# EAGLE design Biosensor_v4_3_20141129 (EAGLE 6.6.0)
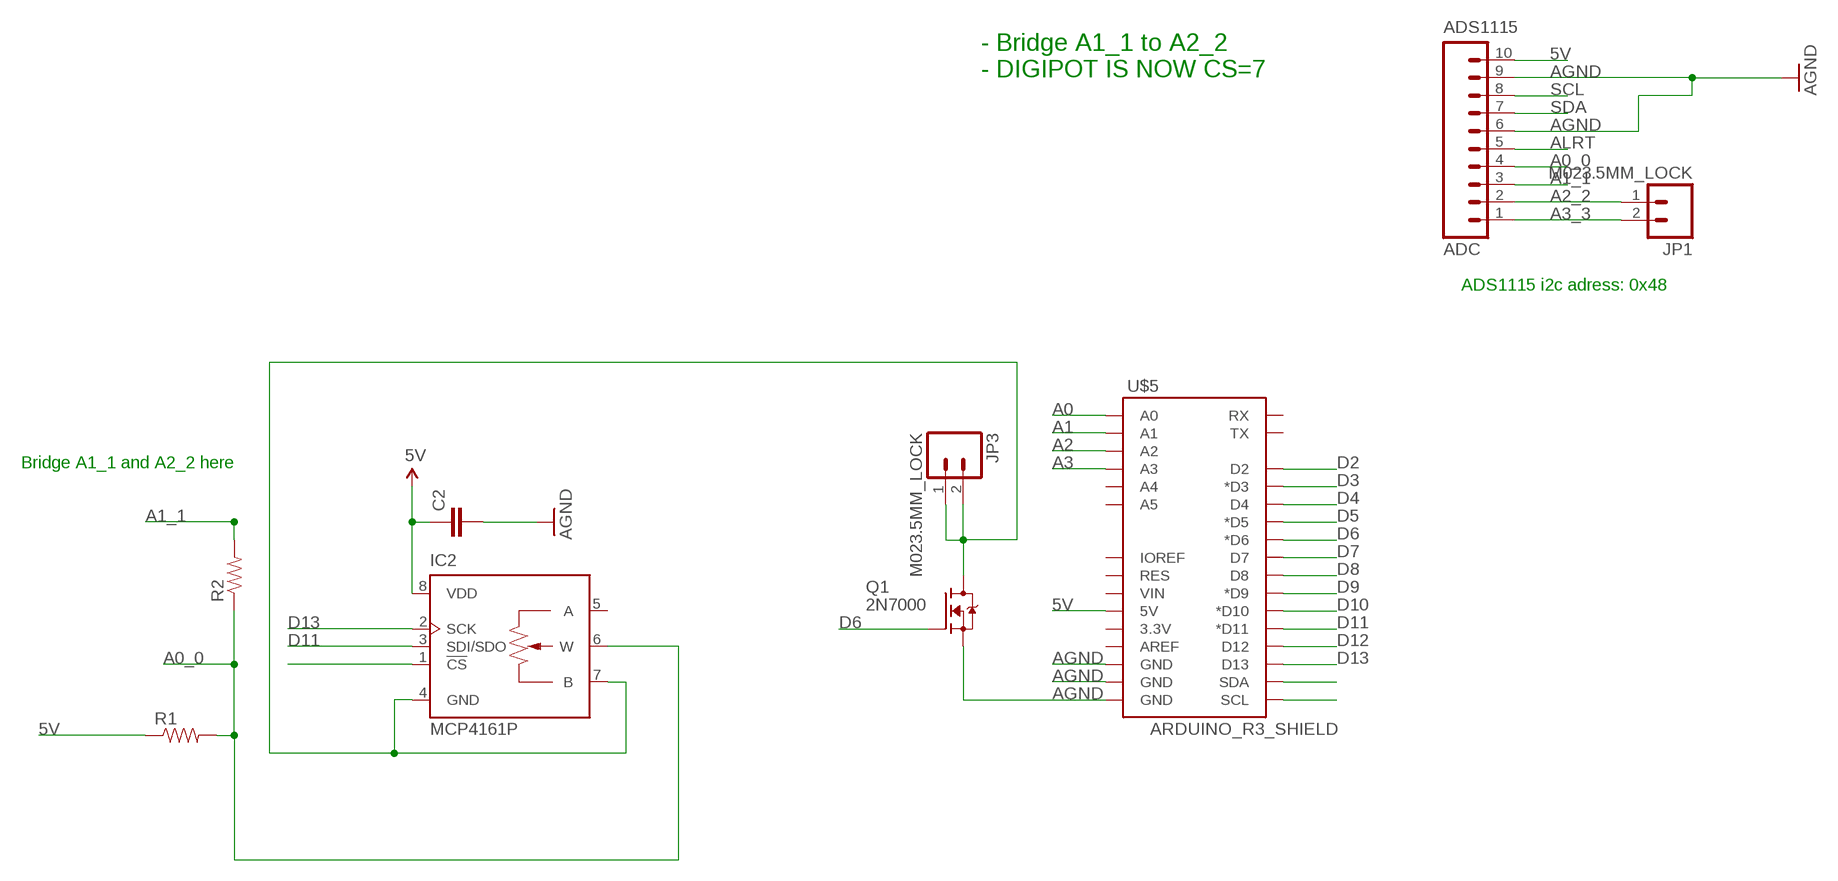
[diagram p0: schematic, sheet 1]

## Parts
ADS1115  ADC  M10LOCK  [1X10_LOCK]
C2  CAPKIT  [CAP-PTH-SMALL-KIT]
IC2  MCP4161P  [DIL08]
JP1  M023.5MM_LOCK  [SCREWTERMINAL-3.5MM-2_LOCK]
JP3  M023.5MM_LOCK  [SCREWTERMINAL-3.5MM-2_LOCK]
Q1  2N7000  [TO-92]
R1  RESISTORPTH-1/2W  [AXIAL-0.5]
R2  RESISTORPTH-1/2W  [AXIAL-0.5]
U$5  ARDUINO_R3_SHIELD  [UNO_R3_SHIELD]

## Nets
5V: ADS1115.10 C2.1 IC2.8(VDD) R1.P$1 U$5.5V
A0: U$5.A0
A0_0: ADS1115.4 IC2.6(W) R1.P$2 R2.P$1
A1: U$5.A1
A1_1: ADS1115.3 R2.P$2
A2: U$5.A2
A2_2: ADS1115.2 JP1.1
A3: U$5.A3
A3_3: ADS1115.1 JP1.2
AGND: ADS1115.6 ADS1115.9 C2.2 Q1.1(S) U$5.GND@0(GND) U$5.GND@1(GND) U$5.GND@2(GND)
ALRT: ADS1115.5
D2: U$5.D2
D3: U$5.D3(*D3)
D4: U$5.D4
D5: U$5.D5(*D5)
D6: Q1.2(G) U$5.D6(*D6)
D7: IC2.1(!CS) U$5.D7
D8: U$5.D8
D9: U$5.D9(*D9)
D10: U$5.D10(*D10)
D11: IC2.3(SDI/SDO) U$5.D11(*D11)
D12: U$5.D12
D13: IC2.2(SCK) U$5.D13
N$3: IC2.4(GND) IC2.7(B) JP3.1 JP3.2 Q1.3(D)
SCL: ADS1115.8 U$5.SCL
SDA: ADS1115.7 U$5.SDA
Unconnected: IC2.5(A) U$5.3.3V U$5.A4 U$5.A5 U$5.AREF U$5.IOREF U$5.RES U$5.RX U$5.TX U$5.VIN

## Notes on the sheet
- - Bridge A1_1 to A2_2
  - DIGIPOT IS NOW CS=7
- ADS1115 i2c adress: 0x48
- Bridge A1_1 and A2_2 here

## Library data of the parts
ADS1115 = SparkFun-Connectors:M10: Header 10 Standard 10-pin 0.1" header. Use with straight break away headers (SKU : PRT-00116), right angle break away headers (PRT-00553), swiss pins (PRT-00743), machine pins (PRT-00117), and female headers (PRT-00115).
C2 = SparkFun-Capacitors:CAP: Capacitor Standard 0603 ceramic capacitor, and 0.1" leaded capacitor.
IC2 = MCP4161:MCP4161: Digital POTENTIOMETER
JP1 JP3 = SparkFun-Connectors:M02: Standard 2-pin 0.1" header. Use with - straight break away headers ( PRT-00116) - right angle break away headers (PRT-00553) - swiss pins (PRT-00743) - machine pins (PRT-00117) - female headers (PRT-00115) Molex polarized connector foot print use with: PRT-08233 with associated crimp pins and housings. 2.54_SCREWTERM for use with PRT-10571. 3.5mm Screw Terminal footprints for PRT-08084 5mm Screw Terminal footprints for use with PRT-08433
Q1 = SteveMarple:2N7000: 2N7000 FET
R1 R2 = SparkFun-Resistors:RESISTOR: Resistor Basic schematic elements and footprints for 0603, 1206, and PTH resistors.
U$5 = SparkFun-Boards:ARDUINO_R3_SHIELD: Shield form compatible with the Arduino Uno R3.

## Board
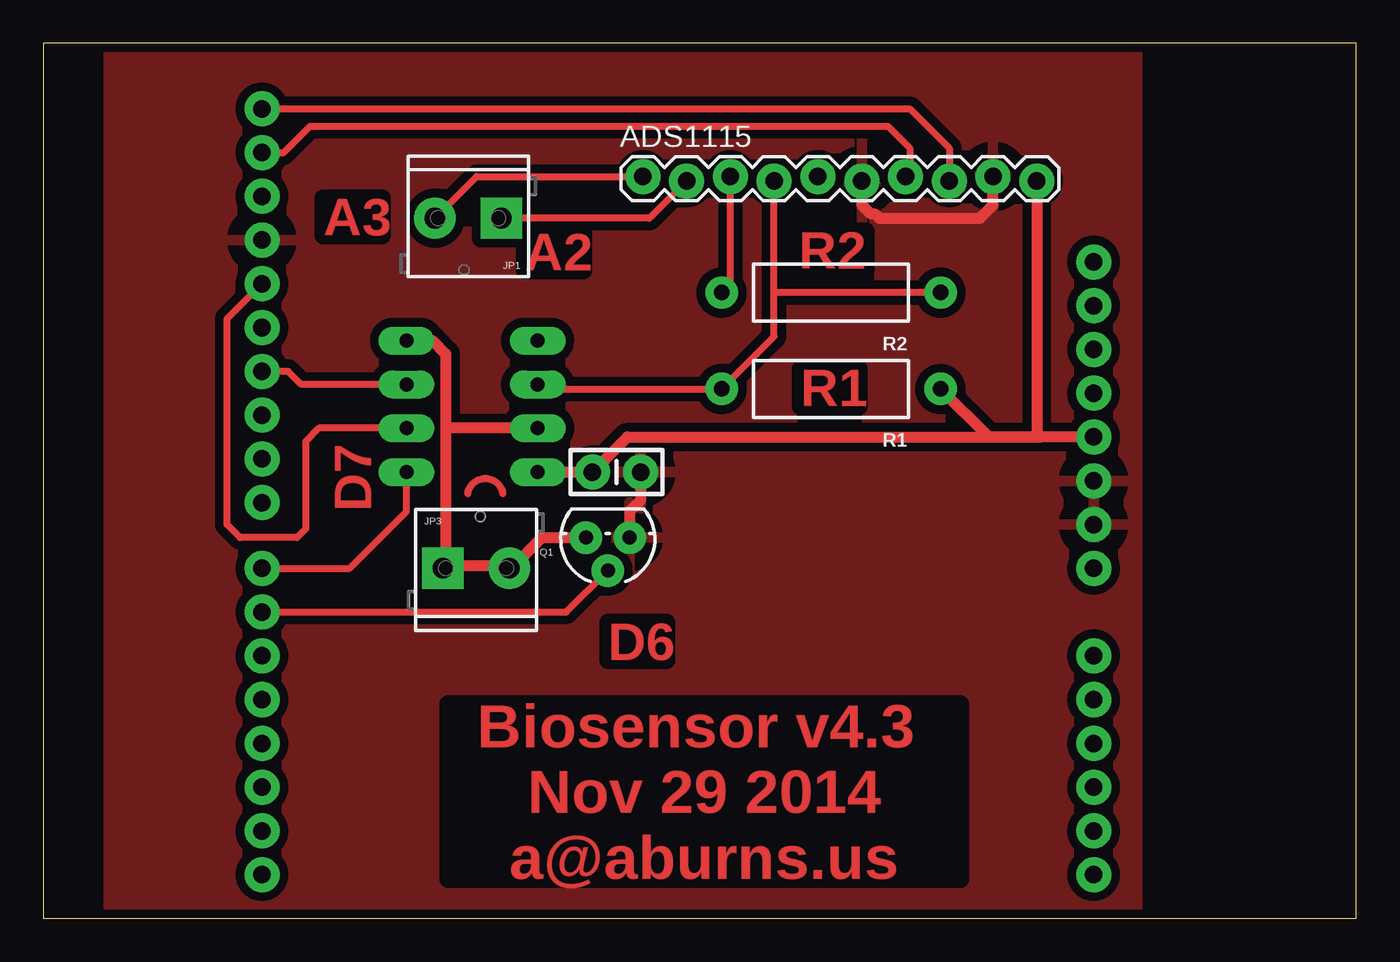
[diagram p1: board, top side]
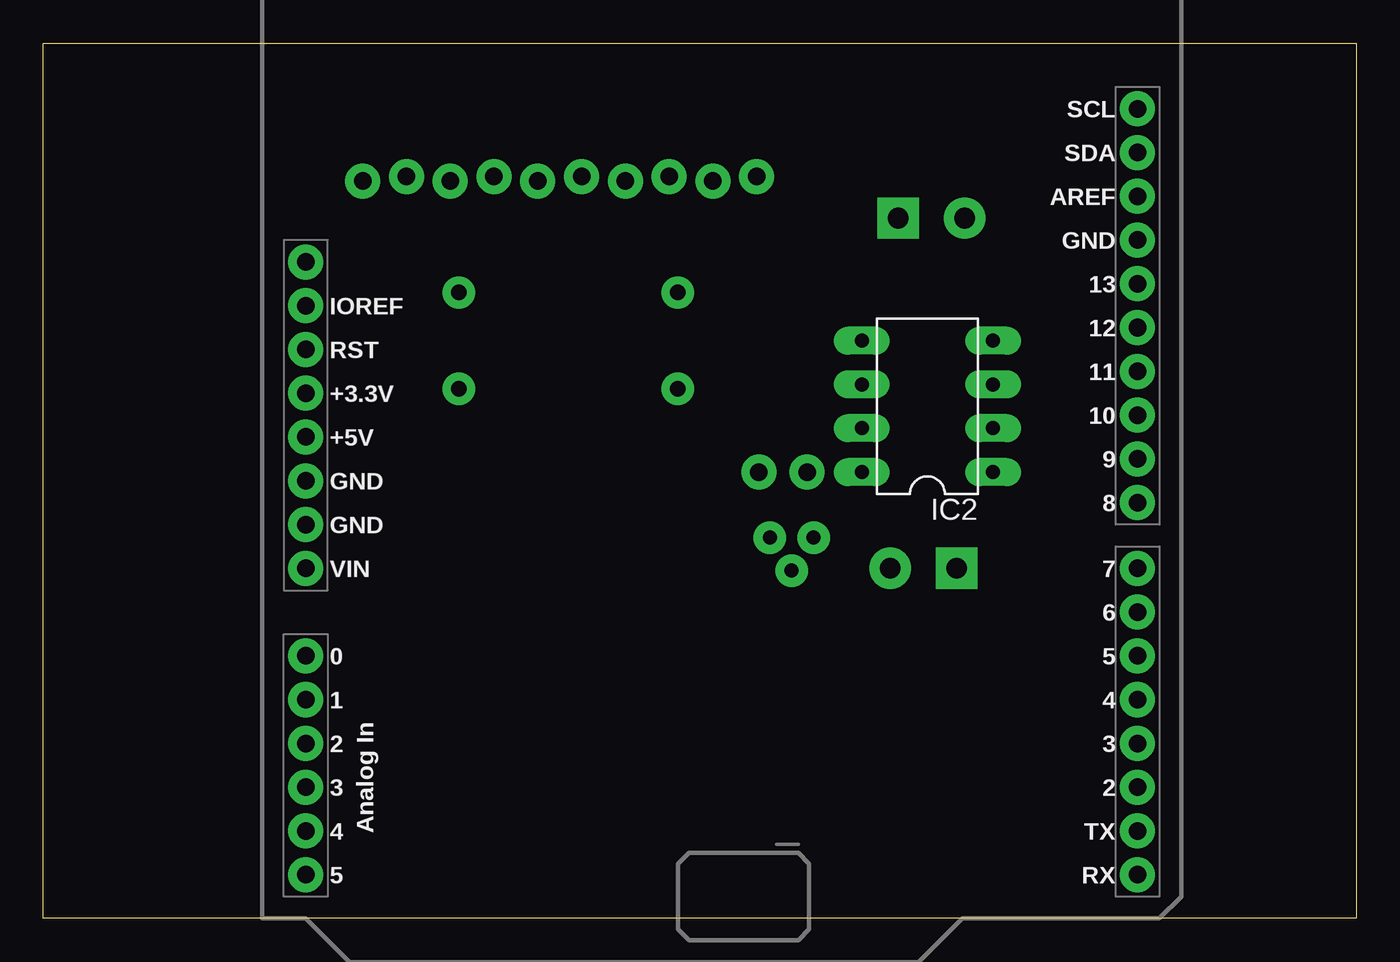
[diagram p2: board, bottom side, seen from below]

Size 76.2 x 50.8 mm. Coordinates in mm from the lower left corner, seen from the top.
Outline: 0,0 76.2,0 76.2,50.8 0,50.8 0,0
Copper layers (1*16): Top 0.035mm / dielectric 1.5mm / Bottom 1mil
Design rules "fablab_Mercedes_customRestring_AJB": minimum track width 13mil, minimum drill 0.8mm, track to track 16mil, track to pad 16mil, pad to pad 16mil, via to via 16mil, smd to smd 16mil, copper to edge 20mil, drill to drill 1mm, minimum pad ring 12mil, minimum via ring 0.8mm, stop-mask expansion 4mil, vias tented up to drill 10mil, thermal gap 1mm

### Footprints (pad centres in the part's own frame; a part is rotated, then mirrored left to right if it is on the bottom)
1X10_LOCK = drill 1.016 pad 1.88: 1 0,0.127; 2 2.54,-0.127; 3 5.08,0.127; 4 7.62,-0.127; 5 10.16,0.127; 6 12.7,-0.127; 7 15.24,0.127; 8 17.78,-0.127; 9 20.32,0.127; 10 22.86,-0.127
CAP-PTH-SMALL-KIT = drill 1.016 pad 2.032: 1 -1.397,0; 2 1.397,0
DIL08 = drill 0.813 long: 1 -3.81,-3.81; 2 -1.27,-3.81; 3 1.27,-3.81; 4 3.81,-3.81; 5 3.81,3.81; 6 1.27,3.81; 7 -1.27,3.81; 8 -3.81,3.81
SCREWTERMINAL-3.5MM-2_LOCK = drill 1.2 pad 2.032 square: 1 -0.178,0 | drill 1.2 pad 2.032: 2 3.678,0
TO-92 = drill 0.813 pad 1.88: 1 -1.27,0; 2 0,1.905; 3 1.27,0
AXIAL-0.5 = drill 0.9 pad 1.88: P$1 -6.35,0; P$2 6.35,0
UNO_R3_SHIELD = drill 1.016 pad 1.88: 3.3V 50.8,26.67; 5V 50.8,29.21; A0 50.8,41.91; A1 50.8,44.45; A2 50.8,46.99; A3 50.8,49.53; A4 50.8,52.07; A5 50.8,54.61; AREF 2.54,15.24; D2 2.54,49.53; D3 2.54,46.99; D4 2.54,44.45; D5 2.54,41.91; D6 2.54,39.37; D7 2.54,36.83; D8 2.54,33.02; D9 2.54,30.48; D10 2.54,27.94; D11 2.54,25.4; D12 2.54,22.86; D13 2.54,20.32; GND@0 50.8,31.75; GND@1 50.8,34.29; GND@2 2.54,17.78; IOREF 50.8,21.59; NC 50.8,19.05; RES 50.8,24.13; RX 2.54,54.61; SCL 2.54,10.16; SDA 2.54,12.7; TX 2.54,52.07; VIN 50.8,36.83

### Placement (x,y rotation side)
ADS1115  34.8,42.93 0 top
C2  33.27,25.91 0 top
IC2  24.89,29.72 90 bottom
JP1  26.42,40.64 180 top
JP3  23.37,20.32 0 top
Q1  32.77,22.1 180 top
R1  45.72,30.73 180 top
R2  45.72,36.32 180 top
U$5  10.16,57.15 180 bottom

### Tracks (layer width: path | path; a pad name or v marks a point on that pad's centre or on a via)
5V
  Top 0.635: IC2.8 C2.1 33.91,27.94 57.91,27.94 | U$5.5V 58.17,27.94 57.91,27.94 | 57.91,27.94 54.86,27.94 R1.P$1 | ADS1115.10 57.66,28.19 57.91,27.94
A0_0
  Top 0.406: IC2.6 28.96,30.73 R1.P$2 42.42,33.78 42.42,36.32 | 42.42,36.32 ADS1115.4 | R2.P$1 42.42,36.32
A1_1
  Top 0.406: R2.P$2 39.88,36.83 ADS1115.3
A2_2
  Top 0.406: ADS1115.2 35.18,40.64 JP1.1
A3_3
  Top 0.406: JP1.2 25.15,43.05 ADS1115.1
AGND
  Top 0.635: C2.2 34.67,24.26 34.04,23.62 Q1.1 | ADS1115.6 47.5,41.4 48.01,40.89 48.26,40.89 48.51,40.64 54.36,40.64 55.12,41.4 ADS1115.9
  pour Top (isolate 0.508): 3.81,0.25 63.5,0.25 63.5,50.8 3.81,50.8
D6
  Top 0.406: U$5.D6 30.35,17.78 Q1.2
D7
  Top 0.406: U$5.D7 17.78,20.32 21.08,23.62 IC2.1
D11
  Top 0.406: IC2.3 14.99,30.99 14.22,31.75 U$5.D11
D13
  Top 0.406: IC2.2 16,28.45 15.24,27.69 15.24,22.61 14.73,22.1 11.43,22.1 10.67,22.86 10.67,34.8 U$5.D13
N$2
  Top 0.406: 24.64,24.64 arc-166 26.67,24.64
N$3
  Top 0.635: IC2.4 22.61,33.53 23.37,32.77 23.37,28.45 | 23.37,28.45 23.37,20.5 | 23.37,20.5 JP3.1 | IC2.7 23.37,28.45 | 23.37,20.5 26.87,20.5 JP3.2 27.18,20.32 28.96,22.1 Q1.3
SCL
  Top 0.406: U$5.SCL 50.29,46.99 52.58,44.7 ADS1115.8
SDA
  Top 0.406: U$5.SDA 13.97,44.45 15.49,45.97 49.02,45.97 50.29,44.7 50.29,43.31 ADS1115.7

### Text on the board
Top: A3 | R2 | A2 | R1 | D7 | D6 | Biosensor v4.3 / Nov 29 2014 / a@aburns.us